# EasyEDA schematic Connectors - RP2040 Advanced Breakout Board v5.2E.json

## Sheets
1 RP2040 Advanced Breakout Board - Version 5.2E - Schematics: TITLE: RP2040 Advanced Breakout Board; REV: 5.2; Date: 2023-05-06; Sheet: 1/2; Drawn By: n-i-x and TheTrain; Company: Open Stick Community
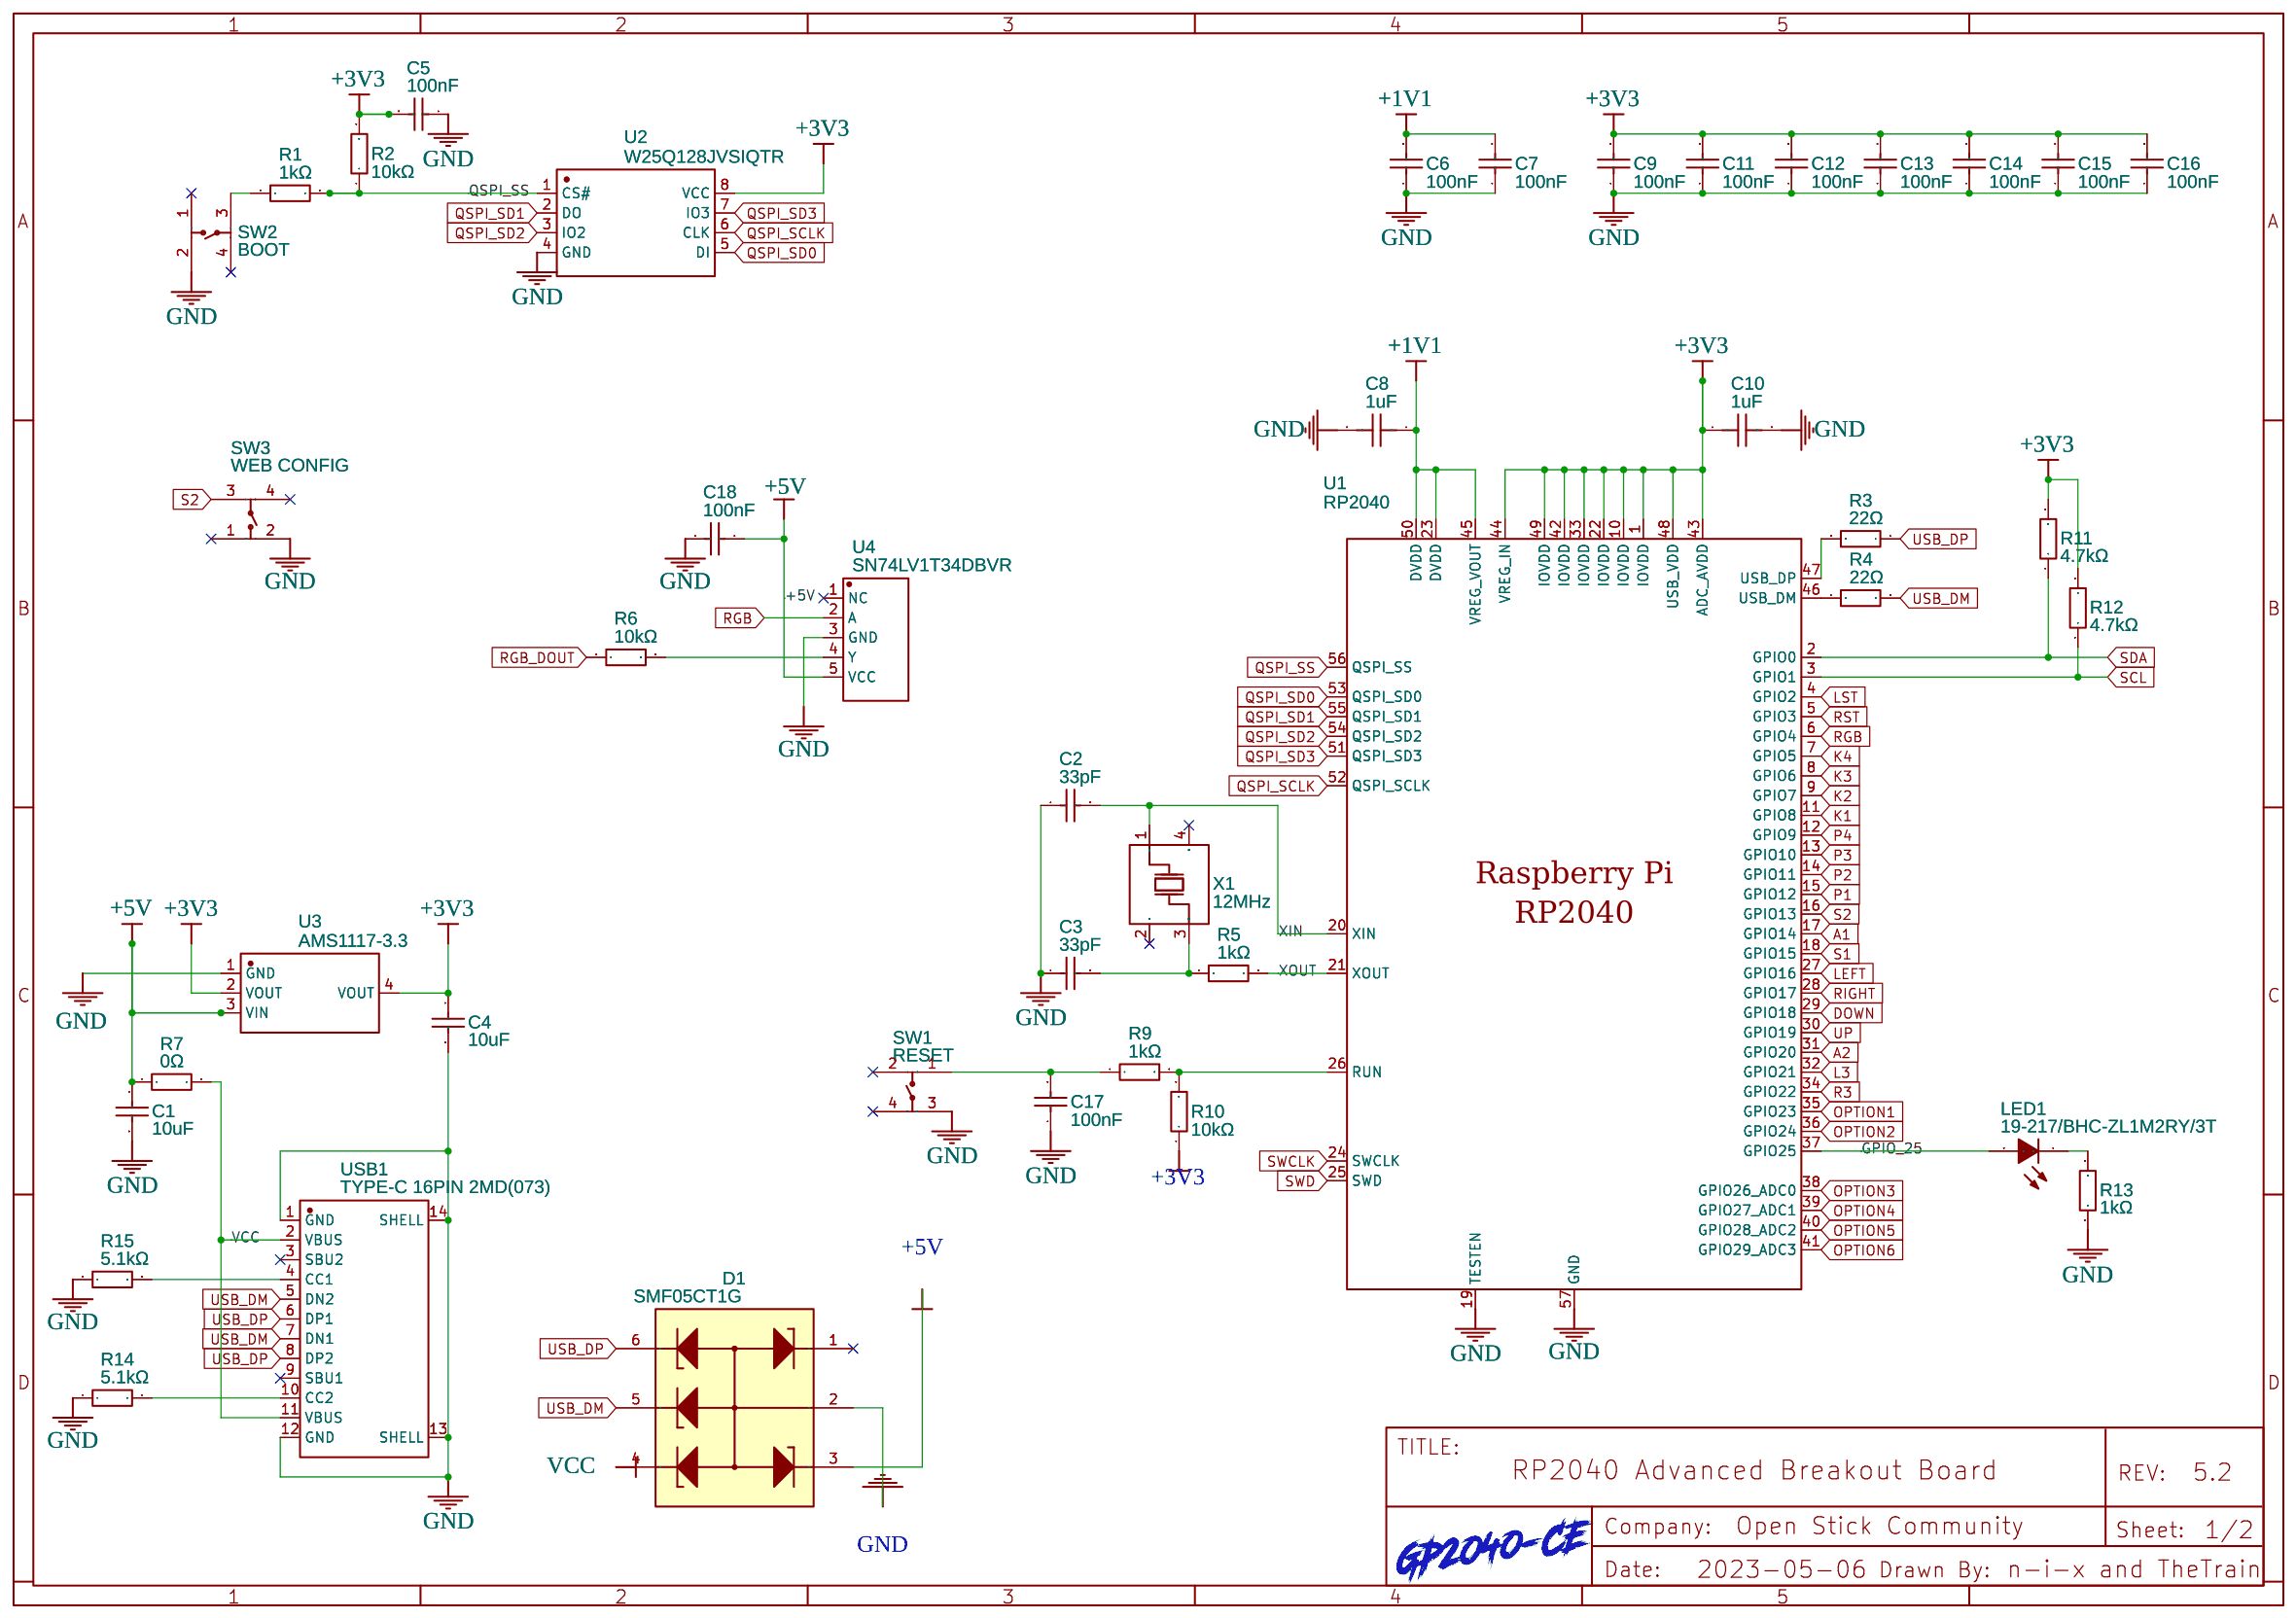
[diagram p0: RP2040 Advanced Breakout Board - Version 5.2E - Schematics]
2 RP2040 Advanced Breakout Board - Version 5.2E - Connectors: Sheet: 2/2
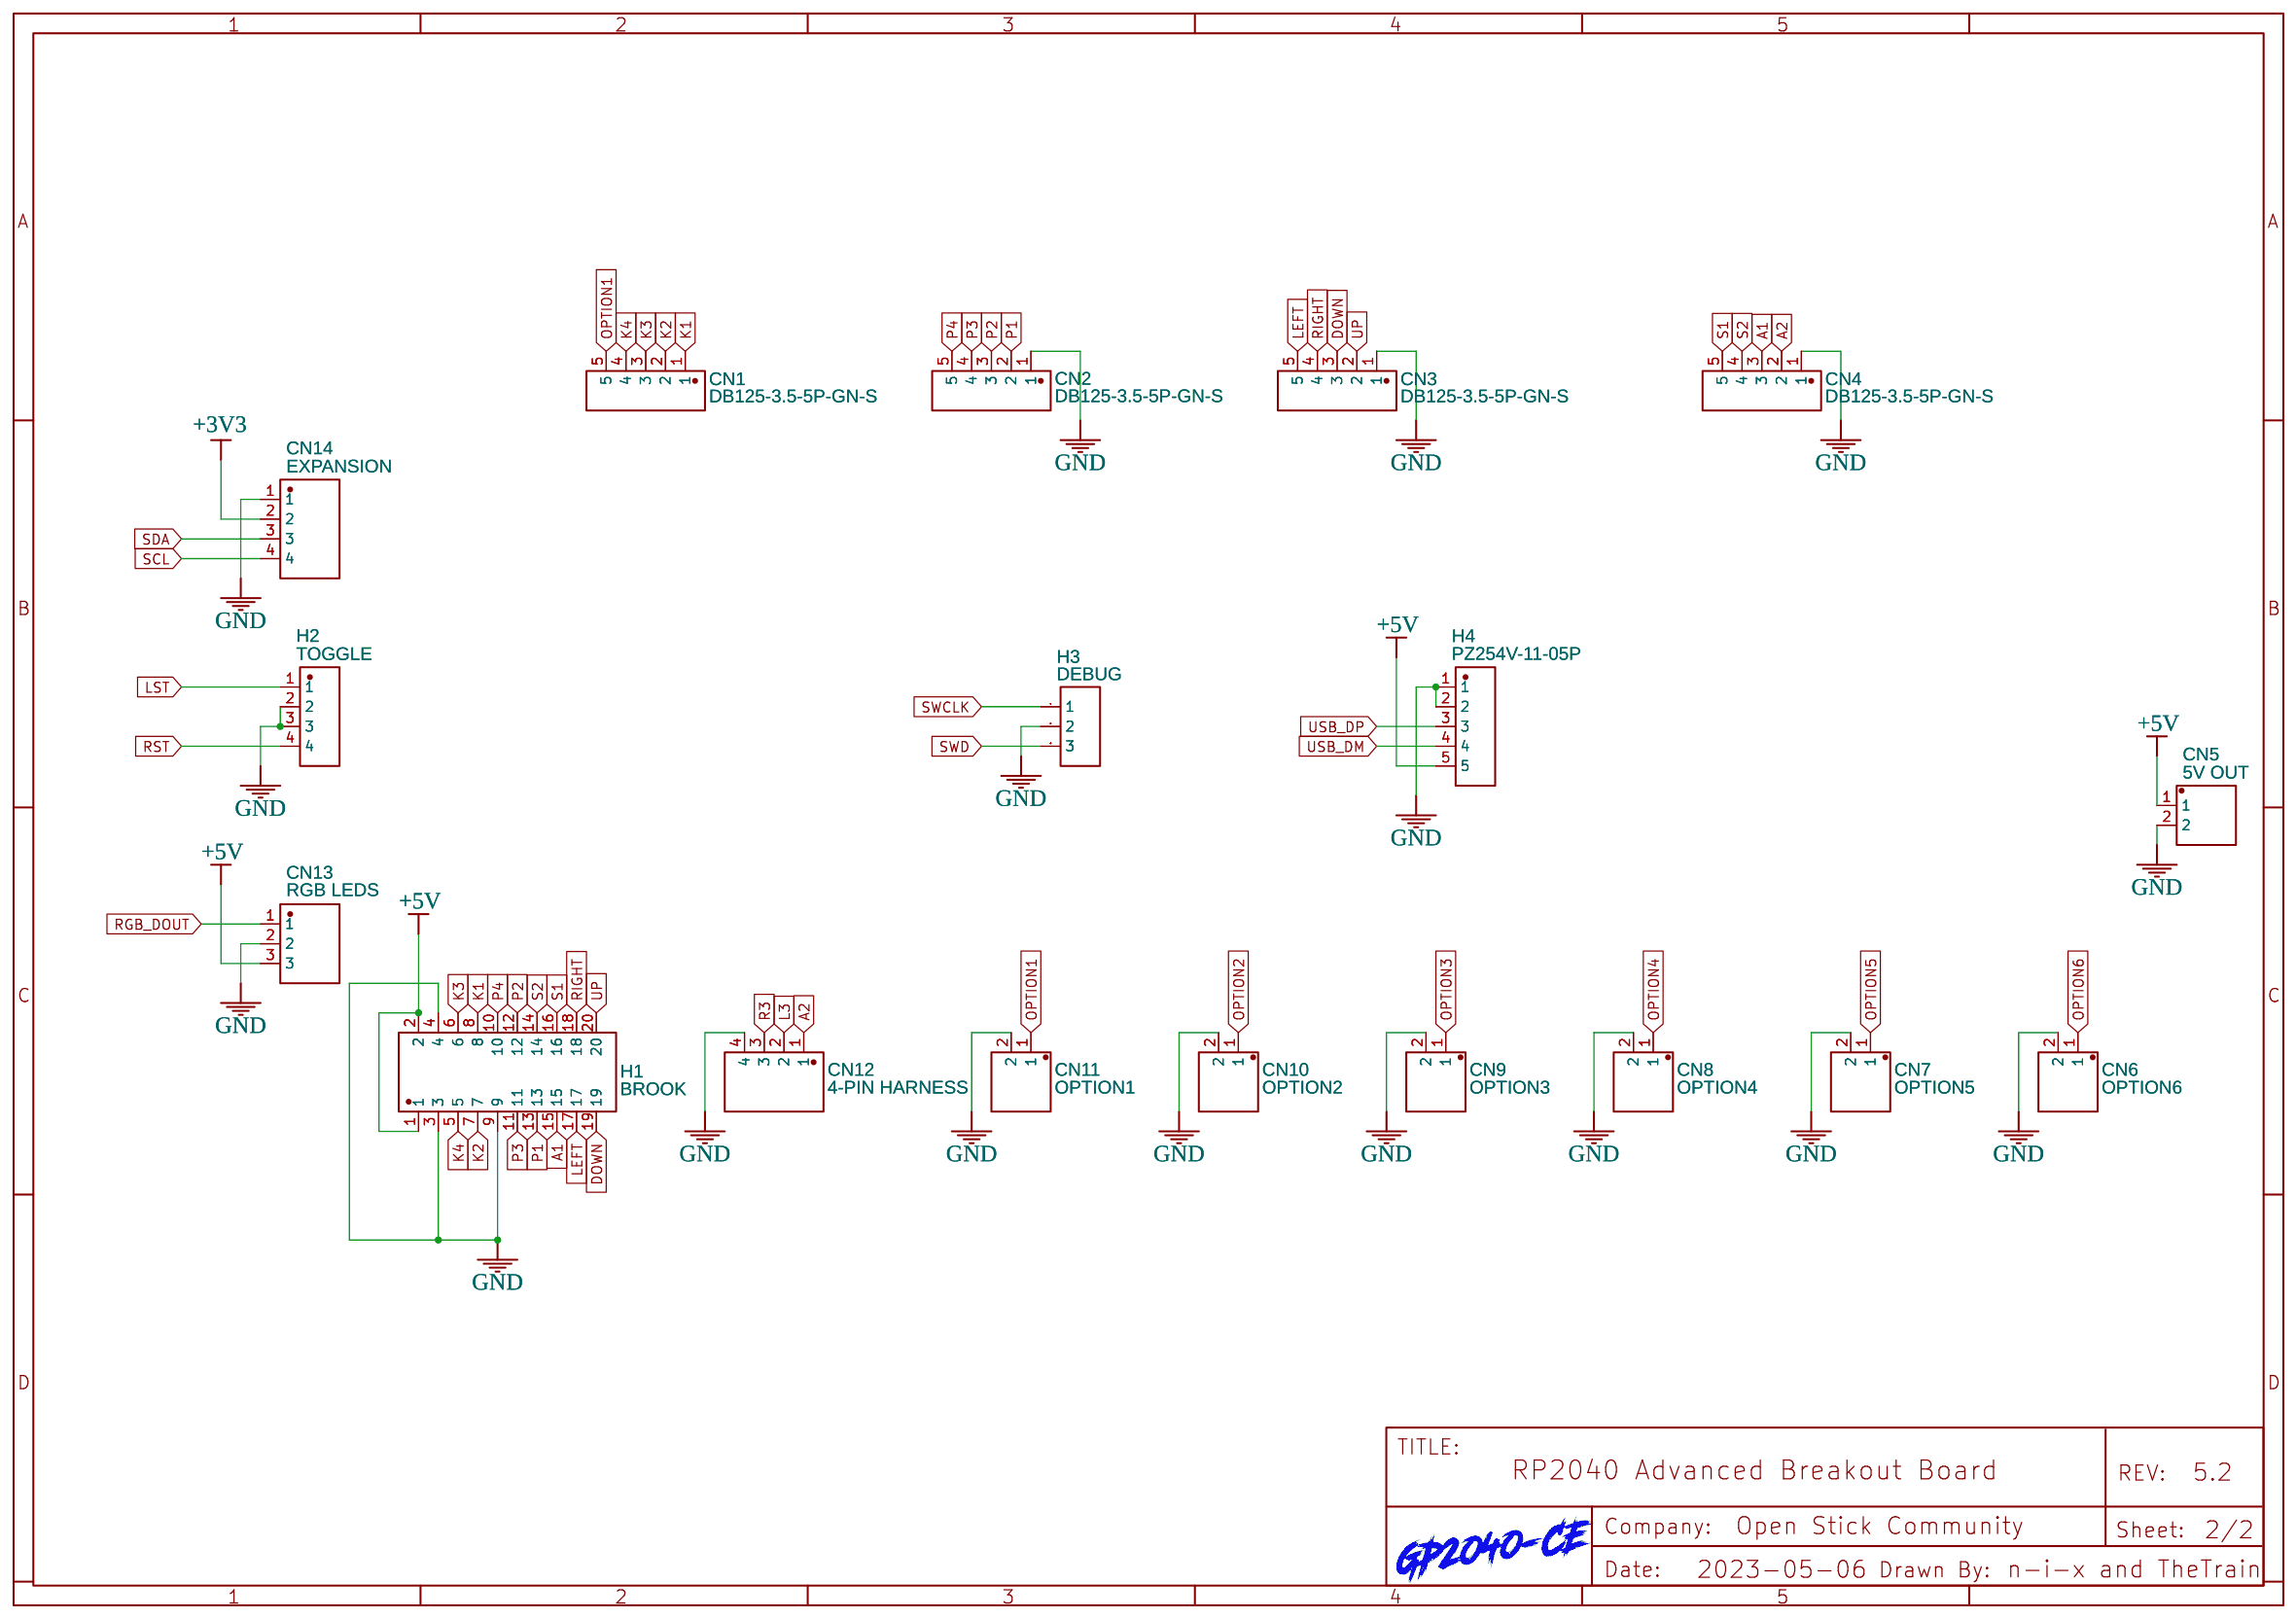
[diagram p1: RP2040 Advanced Breakout Board - Version 5.2E - Connectors]

## Parts
sheet RP2040 Advanced Breakout Board - Version 5.2E - Connectors
CN1  DB125-3.5-5P-GN-S  [CONN-TH_5P-P3.50_DORABO_DB125-3.5-5P-GN-S]
CN2  DB125-3.5-5P-GN-S  [CONN-TH_5P-P3.50_DORABO_DB125-3.5-5P-GN-S]
CN3  DB125-3.5-5P-GN-S  [CONN-TH_5P-P3.50_DORABO_DB125-3.5-5P-GN-S]
CN4  DB125-3.5-5P-GN-S  [CONN-TH_5P-P3.50_DORABO_DB125-3.5-5P-GN-S]
CN5  5V OUT  [CONN-TH_S2B-PH-K-S-LF-SN]
CN6  OPTION6  [CONN-TH_S2B-PH-K-S-LF-SN]
CN7  OPTION5  [CONN-TH_S2B-PH-K-S-LF-SN]
CN8  OPTION4  [CONN-TH_S2B-PH-K-S-LF-SN]
CN9  OPTION3  [CONN-TH_S2B-PH-K-S-LF-SN]
CN10  OPTION2  [CONN-TH_S2B-PH-K-S-LF-SN]
CN11  OPTION1  [CONN-TH_S2B-PH-K-S-LF-SN]
CN12  4-PIN HARNESS  [CONN-TH_4P-P2.00_S4B-PH-K-S-LF-SN]
CN13  RGB LEDS  [CONN-TH_3P-P2.00_S3B-PH-K-S-LF-SN]
CN14  EXPANSION  [CONN-TH_4P-P2.00_S4B-PH-K-S-LF-SN]
H1  BROOK  [HDR-TH_20P-P2.54-V-M-R2-C10-S2.54]
H2  TOGGLE  [HDR-TH_4P-P2.54-H-M-W10.4]
H3  DEBUG  [HDR-TH_3P-P2.54-V-M-1]
H4  PZ254V-11-05P  [HDR-TH_5P-P2.54-V-M]
sheet RP2040 Advanced Breakout Board - Version 5.2E - Schematics
C1  10uF  [C1206]
C2  33pF  [C0402]
C3  33pF  [C0402]
C4  10uF  [C1206]
C5  100nF  [C0402_NEW]
C6  100nF  [C0402_NEW]
C7  100nF  [C0402_NEW]
C8  1uF  [C0402]
C9  100nF  [C0402_NEW]
C10  1uF  [C0402]
C11  100nF  [C0402_NEW]
C12  100nF  [C0402_NEW]
C13  100nF  [C0402_NEW]
C14  100nF  [C0402_NEW]
C15  100nF  [C0402_NEW]
C16  100nF  [C0402_NEW]
C17  100nF  [C0402_NEW]
C18  100nF  [C0402]
D1  SMF05CT1G  [SOT-363_L2.0-W1.3-P0.65-LS2.1-TL]
LED1  19-217/BHC-ZL1M2RY/3T  [LED0603-RD]
R1  1kΩ  [R0402]
R2  10kΩ  [R0402]
R3  22Ω  [R0402]
R4  22Ω  [R0402]
R5  1kΩ  [R0402]
R6  10kΩ  [R0402]
R7  0Ω  [R0603]
R9  1kΩ  [R0402]
R10  10kΩ  [R0402]
R11  4.7kΩ  [R0603]
R12  4.7kΩ  [R0603]
R13  1kΩ  [R0402]
R14  5.1kΩ  [R0402]
R15  5.1kΩ  [R0402]
SW1  RESET  [KEY-SMD_4P-L3.5-W3.0-P1.50-LS4.6]
SW2  BOOT  [KEY-SMD_4P-L3.5-W3.0-P1.50-LS4.6]
SW3  WEB CONFIG  [KEY-SMD_4P-L3.5-W3.0-P1.50-LS4.6]
U1  RP2040  [LQFN-56_L7.0-W7.0-P0.4-EP]
U2  W25Q128JVSIQTR  [SOIC-8_L5.3-W5.3-P1.27-LS8.0-BL]
U3  AMS1117-3.3  [SOT-223-3_L6.5-W3.4-P2.30-LS7.0-BR]
U4  SN74LV1T34DBVR  [SOT-23-5_L2.9-W1.6-P0.95-LS2.8-BR]
USB1  TYPE-C 16PIN 2MD(073)  [USB-C-SMD_TYPE-C-6PIN-2MD-073]
X1  12MHz  [OSC-SMD_4P-L3.2-W2.5-BL]

## Library data of the parts
CN1-CN4 = DB125-3.5-5P-GN-S: Supplier: LCSC; Supplier Part: C3646874; Manufacturer: DIBO(地博电气); link: https://atta.szlcsc.com/upload/public/pdf/source/20220704/B55982FCD9888484FA773053F2EF7F79.pdf; Contributor: lcsc; JLCPCB Part Class: Extended Part
CN5-CN11 = S2B-PH-K-S(LF)(SN): Supplier: LCSC; Supplier Part: C173752; Manufacturer: JST; Contributor: LCSC; JLCPCB Part Class: Extended Part
CN12 CN14 = S4B-PH-K-S-(LF)(SN): Supplier: LCSC; Supplier Part: C157926; Manufacturer: JST; Manufacturer Part: S4B-PH-K-S(LF)(SN); Contributor: LCSC; JLCPCB Part Class: Extended Part
CN13 = S3B-PH-K-S-(LF)(SN): Supplier: LCSC; Supplier Part: C157929; Manufacturer: JST; Manufacturer Part: S3B-PH-K-S(LF)(SN); Contributor: LCSC; JLCPCB Part Class: Extended Part
H1 = PZ254V-12-20P: Supplier: LCSC; Supplier Part: C492427; Manufacturer: XFCN(兴飞); Contributor: LCSC; JLCPCB Part Class: Extended Part
H2 = 2.54-1*4P反弯排针: Supplier: LCSC; Supplier Part: C91552; Manufacturer: BOOMELE(博穆精密); Contributor: LCSC; JLCPCB Part Class: Extended Part
H3 = Header-Male-2.54_1x3: Supplier: LCSC; Manufacturer: BOOMELE(博穆精密); Manufacturer Part: 2.54-1*3P针; Supplier Part: C49257; JLCPCB Part Class: Extended Part
H4 = PZ254V-11-05P: Supplier: LCSC; Supplier Part: C492404; Manufacturer: XFCN(兴飞); Contributor: LCSC; JLCPCB Part Class: Extended Part
C1 C4 = CL31A106KBHNNNE: Supplier: LCSC; Manufacturer: SAMSUNG(三星); Supplier Part: C13585; JLCPCB Part Class: Basic Part
C2 C3 = 0402CG330J500NT: Supplier: LCSC; Manufacturer: FH(风华); Supplier Part: C1562; JLCPCB Part Class: Basic Part
C5-C7 C9 C11-C18 = CL05B104KO5NNNC: Supplier: LCSC; Manufacturer: SAMSUNG(三星); Supplier Part: C1525; JLCPCB Part Class: Basic Part
C8 C10 = CL05A105KA5NQNC: Supplier: LCSC; Manufacturer: SAMSUNG(三星); Supplier Part: C52923; JLCPCB Part Class: Basic Part
D1 = SMF05CT1G: Supplier: LCSC; Manufacturer: onsemi(安森美); Supplier Part: C15879; JLCPCB Part Class: Basic Part
LED1 = 19-217/BHC-ZL1M2RY/3T: Supplier: LCSC; Manufacturer: EVERLIGHT(亿光); Supplier Part: C72041; JLCPCB Part Class: Basic Part
R1 R5 R9 R13 = 0402WGF1001TCE: Supplier: LCSC; Manufacturer: UNI-ROYAL(厚声); Supplier Part: C11702; Resistance (Ohms): 1K; JLCPCB Part Class: Basic Part
R2 R6 R10 = 0402WGF1002TCE: Supplier: LCSC; Manufacturer: UNI-ROYAL(厚声); Supplier Part: C25744; Resistance (Ohms): 10K; JLCPCB Part Class: Basic Part
R3 R4 = 0402WGF220JTCE: Supplier: LCSC; Manufacturer: UNI-ROYAL(厚声); Supplier Part: C25092; Resistance (Ohms): 22; JLCPCB Part Class: Basic Part
R7 = 0603WAF0000T5E: Supplier: LCSC; Manufacturer: UNI-ROYAL(厚声); Supplier Part: C21189; Resistance (Ohms): 0; JLCPCB Part Class: Basic Part
R11 R12 = 0603WAF4701T5E: Supplier: LCSC; Manufacturer: UNI-ROYAL(厚声); Supplier Part: C23162; Resistance (Ohms): 4.7K; JLCPCB Part Class: Basic Part
R14 R15 = 0402WGF5101TCE: Supplier: LCSC; Manufacturer: UNI-ROYAL(厚声); Supplier Part: C25905; Resistance (Ohms): 5.1K; JLCPCB Part Class: Basic Part
SW1-SW3 = TD-1182SA-2.0H-250: Supplier: LCSC; Supplier Part: C2905178; Manufacturer: DEALON(德艺隆); Contributor: LCSC; JLCPCB Part Class: Extended Part
U1 = RP2040: Supplier: LCSC; Supplier Part: C2040; Manufacturer: Raspberry Pi(树莓派); JLCPCB Part Class: Extended Part; Contributor: LCSC
U2 = W25Q128JVSIQTR: Supplier: LCSC; Manufacturer: WINBOND(华邦); Manufacturer Part: W25Q128JVSIQ; Supplier Part: C97521; JLCPCB Part Class: Basic Part
U3 = AMS1117-3.3: sourceId: dwIGgezVh; Supplier: LCSC; Manufacturer: AMS; Supplier Part: C6186; JLCPCB Part Class: Basic Part
U4 = SN74LV1T34DBVR: Supplier: LCSC; Manufacturer: TI(德州仪器); Supplier Part: C100024; JLCPCB Part Class: Extended Part
USB1 = TYPE-C 16PIN 2MD(073): Supplier: LCSC; Supplier Part: C2765186; Manufacturer: SHOU HAN(首韩); Contributor: LCSC; JLCPCB Part Class: Extended Part
X1 = X322512MSB4SI: Supplier: LCSC; Manufacturer: YXC; Supplier Part: C9002; JLCPCB Part Class: Basic Part

## Nets
+1V1: C6.2 C7.2 C8.1 U1.23(DVDD) U1.45(VREG_VOUT) U1.50(DVDD)
+3V3: C4.1 C5.2 C9.2 C10.1 C11.2 C12.2 C13.2 C14.2 C15.2 C16.2 CN14.2 R2.2 R10.1 R11.2 R12.2 U1.1(IOVDD) U1.10(IOVDD) U1.22(IOVDD) U1.33(IOVDD) U1.42(IOVDD) U1.43(ADC_AVDD) U1.44(VREG_IN) U1.48(USB_VDD) U1.49(IOVDD) U2.8(VCC) U3.2(VOUT) U3.4(VOUT)
+5V: C1.1 C18.2 CN5.1 CN13.3 D1.3 H1.1 H1.2 H4.5 R7.1 U3.3(VIN) U4.5(VCC)
GND: C1.2 C2.1 C3.1 C4.2 C5.1 C6.1 C7.1 C8.2 C9.1 C10.2 C11.1 C12.1 C13.1 C14.1 C15.1 C16.1 C17.1 C18.1 CN2.1 CN3.1 CN4.1 CN5.2 CN6.2 CN7.2 CN8.2 CN9.2 CN10.2 CN11.2 CN12.4 CN13.2 CN14.1 D1.2 H1.3 H1.4 H1.9 H2.2 H2.3 H3.2 H4.1 H4.2 R13.1 R14.1 R15.1 SW1.3 SW2.2 SW3.2 U1.19(TESTEN) U1.57(GND) U2.4(GND) U3.1(GND) U4.3(GND) USB1.1(GND) USB1.12(GND) USB1.13(SHELL) USB1.14(SHELL)
VCC: D1.4 R7.2 USB1.2(VBUS) USB1.11(VBUS)
A1: CN4.3 H1.15 U1.17(GPIO14)
A2: CN4.2 CN12.1 U1.31(GPIO20)
DOWN: CN3.3 H1.19 U1.29(GPIO18)
GPIO_25: LED1.2(A) U1.37(GPIO25)
K1: CN1.1 H1.8 U1.11(GPIO8)
K2: CN1.2 H1.7 U1.9(GPIO7)
K3: CN1.3 H1.6 U1.8(GPIO6)
K4: CN1.4 H1.5 U1.7(GPIO5)
L3: CN12.2 U1.32(GPIO21)
LEFT: CN3.5 H1.17 U1.27(GPIO16)
LST: H2.1 U1.4(GPIO2)
OPTION1: CN1.5 CN11.1 U1.35(GPIO23)
OPTION2: CN10.1 U1.36(GPIO24)
OPTION3: CN9.1 U1.38(GPIO26_ADC0)
OPTION4: CN8.1 U1.39(GPIO27_ADC1)
OPTION5: CN7.1 U1.40(GPIO28_ADC2)
OPTION6: CN6.1 U1.41(GPIO29_ADC3)
P1: CN2.2 H1.13 U1.15(GPIO12)
P2: CN2.3 H1.12 U1.14(GPIO11)
P3: CN2.4 H1.11 U1.13(GPIO10)
P4: CN2.5 H1.10 U1.12(GPIO9)
QSPI_SCLK: U1.52(QSPI_SCLK) U2.6(CLK)
QSPI_SD0: U1.53(QSPI_SD0) U2.5(DI)
QSPI_SD1: U1.55(QSPI_SD1) U2.2(DO)
QSPI_SD2: U1.54(QSPI_SD2) U2.3(IO2)
QSPI_SD3: U1.51(QSPI_SD3) U2.7(IO3)
QSPI_SS: R1.2 R2.1 U1.56(QSPI_SS) U2.1(CS#)
R3: CN12.3 U1.34(GPIO22)
RGB: U1.6(GPIO4) U4.2(A)
RGB_DOUT: CN13.1 R6.1
RIGHT: CN3.4 H1.18 U1.28(GPIO17)
RST: H2.4 U1.5(GPIO3)
S1: CN4.5 H1.16 U1.18(GPIO15)
S2: CN4.4 H1.14 SW3.3 U1.16(GPIO13)
SCL: CN14.4 R12.1 U1.3(GPIO1)
SDA: CN14.3 R11.1 U1.2(GPIO0)
SWCLK: H3.1 U1.24(SWCLK)
SWD: H3.3 U1.25(SWD)
UP: CN3.2 H1.20 U1.30(GPIO19)
USB_DM: D1.5 H4.4 R4.2 USB1.5(DN2) USB1.7(DN1)
USB_DP: D1.6 H4.3 R3.1 USB1.6(DP1) USB1.8(DP2)
XIN: C2.2 U1.20(XIN) X1.1(OSC1)
XOUT: R5.2 U1.21(XOUT)
Net-(C3-2): C3.2 R5.1 X1.3(OSC2)
Net-(C17-2): C17.2 R9.1 SW1.1
Net-(LED1-1): LED1.1(C) R13.2
Net-(R1-1): R1.1 SW2.3
Net-(R3-2): R3.2 U1.47(USB_DP)
Net-(R4-1): R4.1 U1.46(USB_DM)
Net-(R6-2): R6.2 U4.4(Y)
Net-(R9-2): R9.2 R10.2 U1.26(RUN)
Net-(R14-2): R14.2 USB1.10(CC2)
Net-(R15-2): R15.2 USB1.4(CC1)

Not connected (* = marked no-connect by the designer): D1 1*; SW1 2* 4*; SW2 1* 4*; SW3 1* 4*; U4 1(NC)*; USB1 3(SBU2)* 9(SBU1)*; X1 2(GND)* 4(GND)*
